# EAGLE design led-taster_4te_v0.01 (EAGLE 6.5.0)
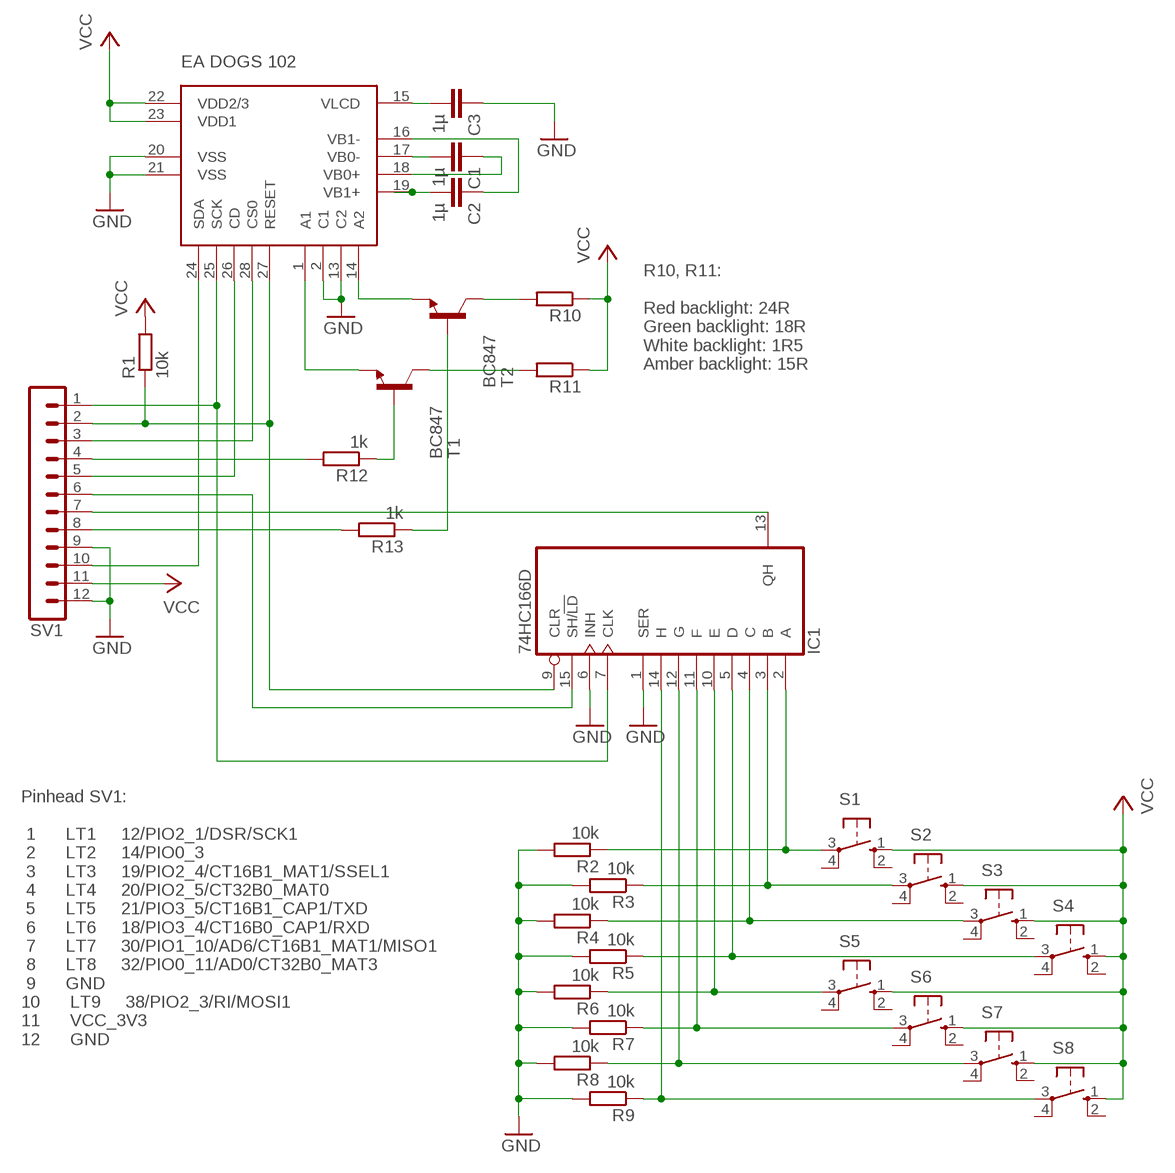
[diagram p0: schematic, sheet 1]

## Parts
C1  1µ  C-EUC1210  [C1210]
C2  1µ  C-EUC1210  [C1210]
C3  1µ  C-EUC1210  [C1210]
EA_DOGS102  DOGS102  [DOGS102]
IC1  74HC166D  [SO16]
R1  10k  R-EU_R1206  [R1206]
R2  10k  R-EU_R1206  [R1206]
R3  10k  R-EU_R1206  [R1206]
R4  10k  R-EU_R1206  [R1206]
R5  10k  R-EU_R1206  [R1206]
R6  10k  R-EU_R1206  [R1206]
R7  10k  R-EU_R1206  [R1206]
R8  10k  R-EU_R1206  [R1206]
R9  10k  R-EU_R1206  [R1206]
R10  R-EU_R1206  [R1206]
R11  R-EU_R1206  [R1206]
R12  1k  R-EU_R1206  [R1206]
R13  1k  R-EU_R1206  [R1206]
S1  10-XX  [B3F-10XX]
S2  10-XX  [B3F-10XX]
S3  10-XX  [B3F-10XX]
S4  10-XX  [B3F-10XX]
S5  10-XX  [B3F-10XX]
S6  10-XX  [B3F-10XX]
S7  10-XX  [B3F-10XX]
S8  10-XX  [B3F-10XX]
SV1  MA12-1  [MA12-1]
T1  BC847  [SOT23]
T2  BC847  [SOT23]

## Nets
+3V3: EA_DOGS102.22(VDD2/3) EA_DOGS102.23(VDD1) R1.2 R10.1 R11.1 S1.1(S) S2.1(S) S3.1(S) S4.1(S) S5.1(S) S6.1(S) S7.1(S) S8.1(S) SV1.11 ; supply symbol labelled VCC
GND: C3.1 EA_DOGS102.2(C1) EA_DOGS102.13(C2) EA_DOGS102.20(VSS) EA_DOGS102.21(VSS) IC1.1(SER) IC1.6(INH) R2.2 R3.2 R4.2 R5.2 R6.2 R7.2 R8.2 R9.2 SV1.9 SV1.12
MISO: IC1.13(QH) SV1.7
MOSI: EA_DOGS102.24(SDA) SV1.10
N$1: IC1.2(A) R2.1 S1.3(P)
N$2: C2.2 EA_DOGS102.19(VB1+)
N$3: C2.1 EA_DOGS102.16(VB1-)
N$4: C1.2 EA_DOGS102.17(VB0-)
N$5: C1.1 EA_DOGS102.18(VB0+)
N$6: C3.2 EA_DOGS102.15(VLCD)
N$7: IC1.3(B) R3.1 S2.3(P)
N$8: IC1.4(C) R4.1 S3.3(P)
N$9: IC1.5(D) R5.1 S4.3(P)
N$10: IC1.10(E) R6.1 S5.3(P)
N$11: IC1.14(H) R9.1 S8.3(P)
N$12: IC1.12(G) R8.1 S7.3(P)
N$13: IC1.11(F) R7.1 S6.3(P)
N$14: EA_DOGS102.28(CS0) SV1.3
N$16: EA_DOGS102.1(A1) T1.2(E)
N$17: EA_DOGS102.14(A2) T2.2(E)
N$18: R10.2 T2.3(C)
N$19: R11.2 T1.3(C)
N$21: R13.1 T2.1(B)
N$22: R12.1 T1.1(B)
N$23: R12.2 SV1.4
N$24: R13.2 SV1.8
N$25: IC1.15(SH/!LD) SV1.6
N$26: EA_DOGS102.26(CD) SV1.5
RESET: EA_DOGS102.27(RESET) IC1.9(CLR) R1.1 SV1.2
SCK: EA_DOGS102.25(SCK) IC1.7(CLK) SV1.1
Unconnected: S1.2(S1) S1.4(P1) S2.2(S1) S2.4(P1) S3.2(S1) S3.4(P1) S4.2(S1) S4.4(P1) S5.2(S1) S5.4(P1) S6.2(S1) S6.4(P1) S7.2(S1) S7.4(P1) S8.2(S1) S8.4(P1)

## Notes on the sheet
- EA DOGS 102
- R10, R11:
  
  Red backlight: 24R
  Green backlight: 18R
  White backlight: 1R5
  Amber backlight: 15R
- Pinhead SV1:
  
   1      LT1     12/PIO2_1/DSR/SCK1
   2      LT2     14/PIO0_3
   3      LT3     19/PIO2_4/CT16B1_MAT1/SSEL1
   4      LT4     20/PIO2_5/CT32B0_MAT0     
   5      LT5     21/PIO3_5/CT16B1_CAP1/TXD 
   6      LT6     18/PIO3_4/CT16B0_CAP1/RXD
   7      LT7     30/PIO1_10/AD6/CT16B1_MAT1/MISO1
   8      LT8     32/PIO0_11/AD0/CT32B0_MAT3
   9      GND
  10      LT9     38/PIO2_3/RI/MOSI1
  11      VCC_3V3
  12      GND

## Power pins joined to a net without a drawn wire
+3V3: IC1.16(VCC)
GND: IC1.8(GND)

## Library data of the parts
C1-C3 = resistor:C-EU: CAPACITOR, European symbol
EA_DOGS102 = EA_DOGS102:DOGS102: DOGS102-6 GRAFIK 102x64 39x41 mm LED-BELEUCHTUNG WEISS, EA LED39X41-W LED-BELEUCHTUNG AMBER, EA LED39X41-A LED-BELEUCHTUNG GR/ROT , EA LED39X41-GR
IC1 = 74xx-eu:74*166: 8-bit parallel load SHIFT REGISTER
R1-R13 = resistor:R-EU_: RESISTOR, European symbol
S1-S8 = switch-omron:10-XX: OMRON SWITCH; MPN: B3F-1000; OC_FARNELL: 176432; OC_NEWARK: 36M3542
SV1 = con-lstb:MA12-1: PIN HEADER; OC_FARNELL: unknown; OC_NEWARK: unknown
T1 T2 = transistor:BC847: NPN TRANSISTOR

## Board
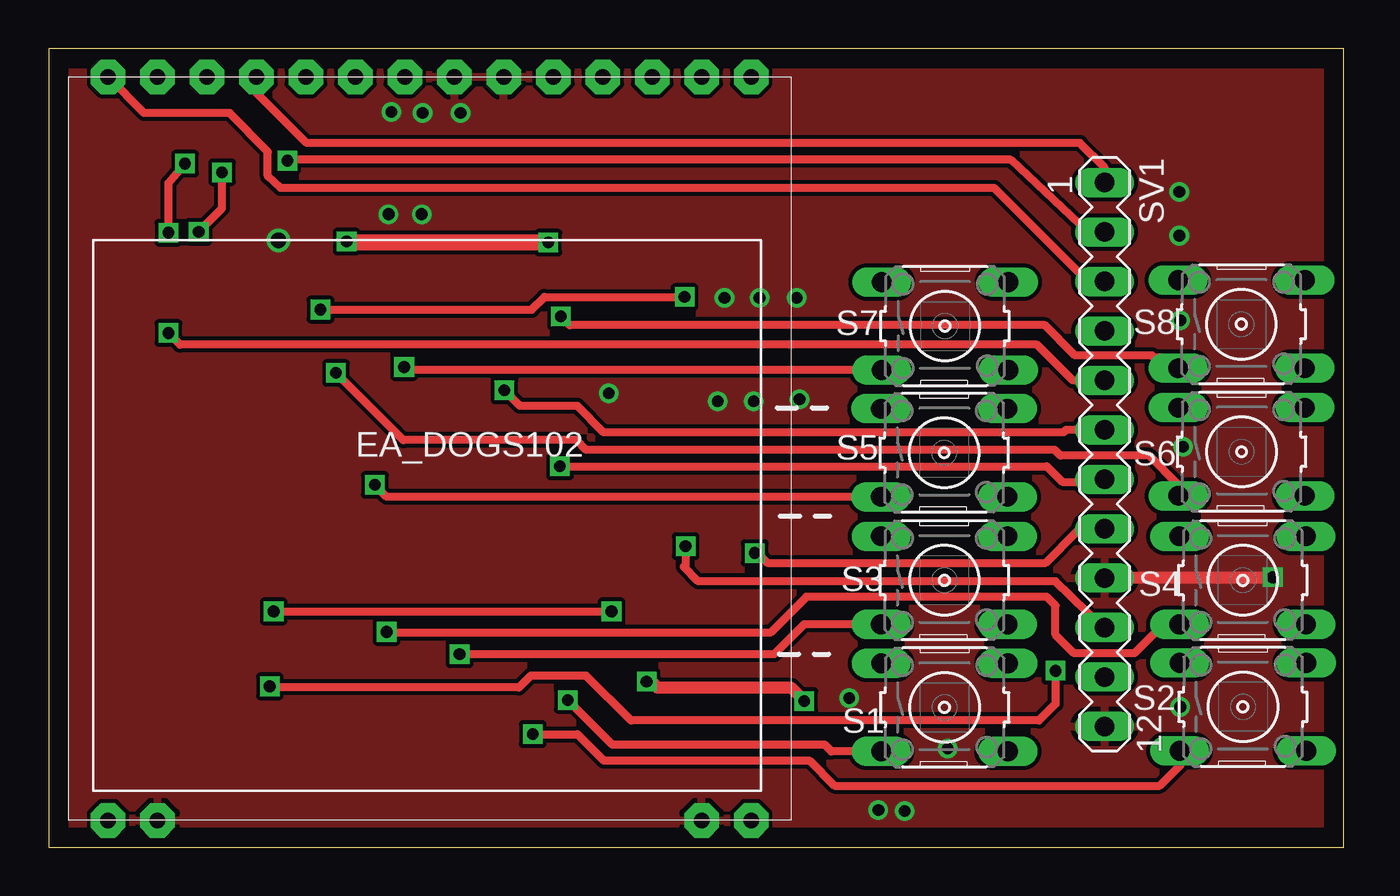
[diagram p1: board, top side]
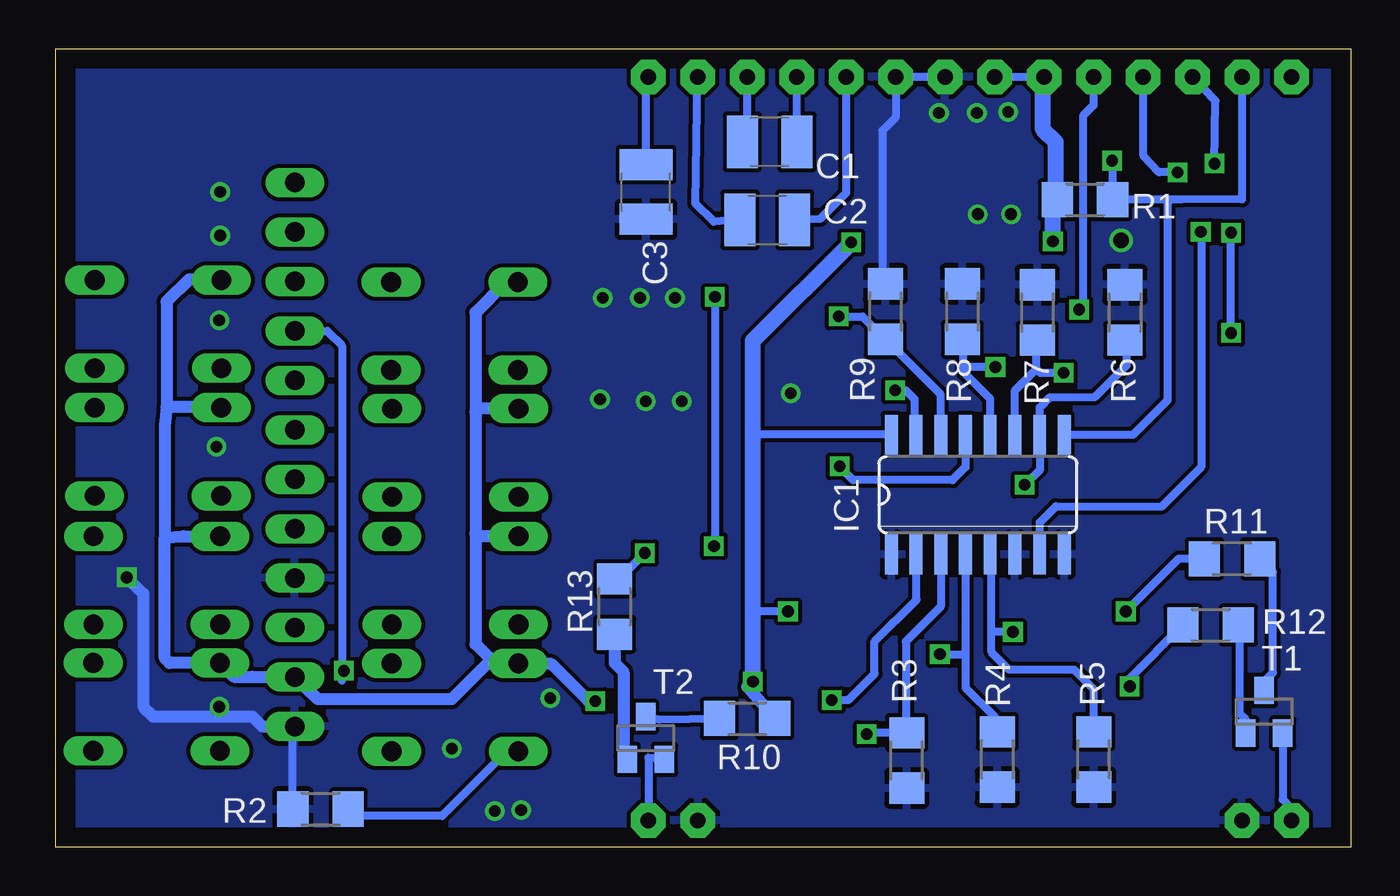
[diagram p2: board, bottom side, seen from below]

Size 66.5 x 41 mm. Coordinates in mm from the lower left corner, seen from the top.
Outline: 0,0 66.5,0 66.5,41 0,41 0,0
Copper layers (1*16): Top 0.035mm / dielectric 1.5mm / Bottom 0.035mm
Design rules "default": minimum track width 10mil, minimum drill 24mil, track to track 8mil, track to pad 8mil, pad to pad 8mil, via to via 8mil, smd to smd 8mil, copper to edge 40mil, drill to drill 8mil, minimum pad ring 10mil, minimum via ring 8mil, stop-mask expansion 4mil, vias tented up to drill 0mil, thermal gap 10mil

### Footprints (pad centres in the part's own frame; a part is rotated, then mirrored left to right if it is on the bottom)
C1210 = smd 1.6 x 2.7: 1 -1.4,0; 2 1.4,0
DOGS102 = drill 0.8 pad 1.778 octagon: 1 2.032,1.016; 2 4.572,1.016; 13 32.512,1.016; 14 35.052,1.016; 15 35.052,39.202; 16 32.512,39.202; 17 29.972,39.202; 18 27.432,39.202; 19 24.892,39.202; 20 22.352,39.202; 21 19.812,39.202; 22 17.272,39.202; 23 14.732,39.202; 24 12.192,39.202; 25 9.652,39.202; 26 7.112,39.202; 27 4.572,39.202; 28 2.032,39.202
SO16 = smd 0.66 x 2.032: 1 -4.445,-3.073; 2 -3.175,-3.073; 3 -1.905,-3.073; 4 -0.635,-3.073; 5 0.635,-3.073; 6 1.905,-3.073; 7 3.175,-3.073; 8 4.445,-3.073; 9 4.445,3.073; 10 3.175,3.073; 11 1.905,3.073; 12 0.635,3.073; 13 -0.635,3.073; 14 -1.905,3.073; 15 -3.175,3.073; 16 -4.445,3.073
R1206 = smd 1.6 x 1.803: 1 -1.422,0; 2 1.422,0
B3F-10XX = drill 1.016 long: 1 -3.251,2.261; 2 3.251,2.261; 3 -3.251,-2.261; 4 3.251,-2.261
MA12-1 = drill 1.016 long: 1 -13.97,0; 2 -11.43,0; 3 -8.89,0; 4 -6.35,0; 5 -3.81,0; 6 -1.27,0; 7 1.27,0; 8 3.81,0; 9 6.35,0; 10 8.89,0; 11 11.43,0; 12 13.97,0
SOT23 = smd 1 x 1.4: 1 -0.95,-1.1; 2 0.95,-1.1; 3 0,1.1

### Placement (x,y rotation side)
C1  29.84,36.21 180 bottom
C2  29.96,32.21 0 bottom
C3  36.19,33.64 90 bottom
EA_DOGS102  1.02,0.35 0 top
IC1  19.15,18.1 0 bottom
R1  13.65,33.24 180 bottom
R2  52.9,1.95 180 bottom
R3  22.8,4.45 270 bottom
R4  18.15,4.5 270 bottom
R5  13.2,4.5 270 bottom
R6  11.6,27.45 90 bottom
R7  16.1,27.45 90 bottom
R8  19.95,27.5 90 bottom
R9  23.9,27.5 90 bottom
R10  31,6.6 180 bottom
R11  6.1,14.8 0 bottom
R12  7.2,11.4 180 bottom
R13  37.8,12.35 90 bottom
S1  46,7.17 0 top
S2  61.32,7.2 0 top
S3  45.99,13.7 0 top
S4  61.31,13.7 0 top
S5  45.98,20.25 0 top
S6  61.25,20.3 0 top
S7  46.02,26.75 0 top
S8  61.24,26.85 0 top
SV1  54.22,20.16 270 top
T1  4.45,6.95 0 bottom
T2  36.2,5.6 0 bottom

### Tracks (layer width: path | path; a pad name or v marks a point on that pad's centre or on a via)
+3V3  (via drill 0.6)
  Top 0.406: v11.55,12.1 v28.9,12.1
  Top 0.61: v30.7,8.5 30.9,8.55 31.25,8.2 38.1,8.2 v38.8,7.5
  Top 0.813: v25.65,31.05 15.35,31.05 v15.3,31.1
  Bottom 0.406: 15.15,33.86 R1.2 | EA_DOGS102.22 EA_DOGS102.23 | IC1.16 30.58,21.17 30.7,21.05 | R11.1 8.85,14.8 v11.55,12.1 | v28.9,12.1 30.7,12.1
  Bottom 0.61: 43.95,9.43 44.32,9.43 46.15,7.6 53.04,7.6 SV1.11 56.38,8.73 56.4,8.75 57.36,8.75 S2.1 60.65,9.45 60.9,9.7 60.9,15.9 | 43.95,9.43 S1.1 42.72,9.4 41.05,9.4 39.15,7.5 v38.8,7.5 | v30.7,8.5 30.98,8.23 R10.1 | 60.9,15.9 59.94,15.96 S4.1 | S6.1 58.04,22.6 60.8,22.6 | 60.8,22.6 60.9,21.65 60.9,15.9 | S8.1 58.03,29.15 59.65,29.15 60.8,28 60.8,22.6 | S7.1 43.39,29.01 44.95,27.45 44.95,22.35 | 44.95,22.35 44.95,16.1 | 44.95,16.1 44.95,10.43 43.95,9.43 | S5.1 44.79,22.51 44.95,22.35 | S3.1 44.81,15.96 44.95,16.1
  Bottom 0.813: v30.7,8.5 30.7,12.1 30.7,21.05 30.7,26 v25.65,31.05 | v15.3,31.1 15.3,33.01 R1.2 | 15.15,33.86 15.15,36.2 15.8,36.85 15.8,39.5 EA_DOGS102.23
GND  (via drill 0.6, 0.8)
  Top 0.61: SV1.9 54.26,13.85 v62.85,13.85
  Bottom 0.406: R2.2 54.32,6.08 SV1.12 | EA_DOGS102.21 EA_DOGS102.20 23.37,37.48 24.05,36.8 24.05,29.68 24.02,29.65
  Bottom 0.61: v62.85,13.85 62,13 62,7.2 61.5,6.7 56.4,6.7 55.89,6.19 SV1.12
  other vias: 11.8,31.15 17.45,32.5 19.15,32.5 28.75,23.3 34.35,22.9 36.2,22.9 38.55,23 41.1,7.65 38.4,28.2 36.5,28.2 34.7,28.2 17.6,37.75 19.2,37.7 21.15,37.7 58.25,20.55 58.1,27.05 58.05,31.4 58.05,33.65 58.1,7.2 43.95,1.85 42.6,1.9 46.15,5.05
  pour Top: -0.65,42.3 67.7,42.3 67.7,-1 -0.9,-1 -0.9,25.75
  pour Bottom: -0.45,41.8 67.25,41.8 67.25,41.65 67.25,-0.55 -0.45,-0.55 -0.45,-0.2
MISO  (via drill 0.6)
  Top 0.406: v26.25,19.55 51.25,19.55 52.05,18.75 54.08,18.75 SV1.7
  Bottom 0.406: IC1.13 19.79,19.52 20.45,18.85 25.55,18.85 v26.25,19.55
MOSI  (via drill 0.6)
  Top 0.406: SV1.10 54.13,11.27 51.7,13.65 33.35,13.65 32.6,14.4 32.7,14.5 v32.7,15.45 | v13.95,27.6 24.8,27.6 25.45,28.25 v32.65,28.25
  Bottom 0.406: EA_DOGS102.24 13.21,38.09 13.75,37.55 13.75,27.8 v13.95,27.6 | v32.65,28.25 32.65,15.5 v32.7,15.45
N$1  (via drill 0.6)
  Top 0.406: S1.3 40.19,4.91 39.85,5.25 28.95,5.25 v26.65,7.55
  Bottom 0.406: S1.3 43.34,4.91 46.65,1.6 51.43,1.6 R2.1 | v26.65,7.55 25.8,7.55 24.45,8.9 24.45,10.55 22.3,12.7 22.3,15 IC1.2
N$2
  Bottom 0.406: C2.2 27.24,32.26 25.9,33.6 25.9,39.55 EA_DOGS102.19
N$3
  Bottom 0.406: C2.1 32.71,32.11 33.65,33.05 33.55,39.53 EA_DOGS102.16
N$4
  Bottom 0.406: C1.2 30.99,35.66 EA_DOGS102.17
N$5
  Bottom 0.406: C1.1 28.45,35.66 EA_DOGS102.18
N$6
  Bottom 0.406: C3.2 36.19,39.43 EA_DOGS102.15
N$7  (via drill 0.6)
  Top 0.406: v24.85,5.8 27.15,5.8 28.5,4.45 39.05,4.45 40.35,3.15 57.05,3.15 58.15,4.25 58.15,4.86 S2.3
  Bottom 0.406: IC1.3 21.05,12.35 22.85,10.55 22.85,5.92 R3.1 24.78,5.87 v24.85,5.8
N$8  (via drill 0.6)
  Top 0.406: S3.3 38.79,11.44 37.25,9.9 v21.1,9.9
  Bottom 0.406: IC1.4 19.79,9.9 | 19.79,9.9 19.79,8.19 18.3,6.7 18.3,6.07 R4.1 | v21.1,9.9 19.79,9.9
N$9  (via drill 0.6)
  Top 0.406: S4.3 57.24,11.44 55.75,9.95 52.65,9.95 51.7,10.9 51.7,12.4 51.25,12.85 38.9,12.85 37.05,11 17.4,11 v17.35,11.05
  Bottom 0.406: R5.1 13.2,8.1 14.2,9.1 17.55,9.1 18.45,10 18.45,11.05 | 18.45,11.05 18.45,14.96 IC1.5 | v17.35,11.05 18.45,11.05
N$10  (via drill 0.6)
  Top 0.406: S5.3 17.36,17.99 v16.75,18.6
  Bottom 0.406: R6.1 11.5,25.93 11.5,24.75 13.15,23.1 15.45,23.1 15.97,22.57 IC1.10 15.95,21.15 15.95,19.4 v16.75,18.6
N$11  (via drill 0.6)
  Top 0.406: S8.3 57.86,24.59 57.3,25.15 56.75,25.15 56.65,25.25 52.7,25.25 51.15,26.8 26.75,26.8 v26.3,27.25
  Bottom 0.406: IC1.14 21.05,23.23 R9.1 25.07,27.25 v26.3,27.25
N$12  (via drill 0.6)
  Top 0.406: S7.3 18.41,24.49 v18.25,24.65
  Bottom 0.406: IC1.12 18.52,23.02 19.9,24.4 19.9,24.65 | 19.9,24.65 19.9,26.03 R8.1 | v18.25,24.65 19.9,24.65
N$13  (via drill 0.6)
  Top 0.406: S6.3 58,18.6 56.5,20.1 51.95,20.1 51.65,20.4 27.6,20.4 27.1,20.9 18.2,20.9 v14.75,24.35
  Bottom 0.406: IC1.11 17.25,23.45 16.15,24.55 | 16.15,24.55 16.15,25.98 R7.1 | v14.75,24.35 15.95,24.35 16.15,24.55
N$14
  Top 0.406: SV1.3 53.35,29.05 48.55,33.85 11.9,33.85 11.25,34.45 11.25,35.7 9.3,37.7 4.9,37.7 EA_DOGS102.28
N$16
  Bottom 0.406: T1.2 3.5,2.45 3.15,2.1 3.15,1.47 EA_DOGS102.1
N$17
  Bottom 0.406: T2.2 36.07,4.58 EA_DOGS102.14
N$18
  Bottom 0.406: T2.3 35.5,6.55 R10.2
N$19
  Bottom 0.406: T1.3 4.45,8.5 4,8.95 4,14.12 R11.2
N$21
  Bottom 0.61: R13.1 37.8,9.45 37.35,9 37.35,4.7 T2.1
N$22
  Bottom 0.406: T1.1 5.4,6.55 5.7,6.85 5.7,11.32 R12.1
N$23  (via drill 0.6)
  Top 0.406: v51.7,9.05 51.7,7.35 50.85,6.5 29.9,6.5 27.6,8.8 24.75,8.8 24.15,8.2 11.4,8.2 v11.35,8.25
  Bottom 0.406: SV1.4 52.56,26.51 51.8,25.75 51.8,8.55 v51.7,9.05 | v11.35,8.25 11.35,8.67 R12.2
N$24  (via drill 0.6)
  Top 0.406: v36.25,15.1 36.4,15.1 36.9,14.6 51.2,14.6 52.85,16.25 54.12,16.25 SV1.8
  Bottom 0.406: R13.2 37.58,13.77 v36.25,15.1
N$25  (via drill 0.6)
  Top 0.406: SV1.6 52.23,21.43 52.1,21.3 28.5,21.3 27.15,22.65 24.2,22.65 v23.4,23.45
  Bottom 0.406: v23.4,23.45 22.85,23.45 22.4,23 22.4,21.25 IC1.15
N$26  (via drill 0.6)
  Top 0.406: SV1.5 52.58,23.97 50.75,25.8 6.75,25.8 v6.15,26.4 | v6.15,31.55 6.15,34.1 v7,35.1
  Bottom 0.406: v6.15,26.4 v6.15,31.55 | v7,35.1 6.95,38.33 EA_DOGS102.26
RESET  (via drill 0.6)
  Top 0.406: SV1.2 53.36,31.59 49.4,35.3 12.65,35.3 v12.25,35.25
  Bottom 0.406: EA_DOGS102.27 5.59,33.26 8.7,33.25 9.25,33.25 | 9.25,33.25 11.44,33.25 R1.1 12.25,34.06 v12.25,35.25 | IC1.9 11.18,21.17 9.4,22.95 9.4,33.1 9.25,33.25
SCK  (via drill 0.6)
  Top 0.406: v7.7,31.6 8.9,32.8 v8.9,34.65 | SV1.1 54.22,34.88 52.95,36.15 13.25,36.15 10.65,38.75 10.65,39.54 EA_DOGS102.25
  Bottom 0.406: IC1.7 15.97,16.68 15.15,17.5 9.7,17.5 7.65,19.55 7.65,31.55 v7.7,31.6 | v8.9,34.65 9.85,34.65 10.65,35.5 10.65,39.54 EA_DOGS102.25